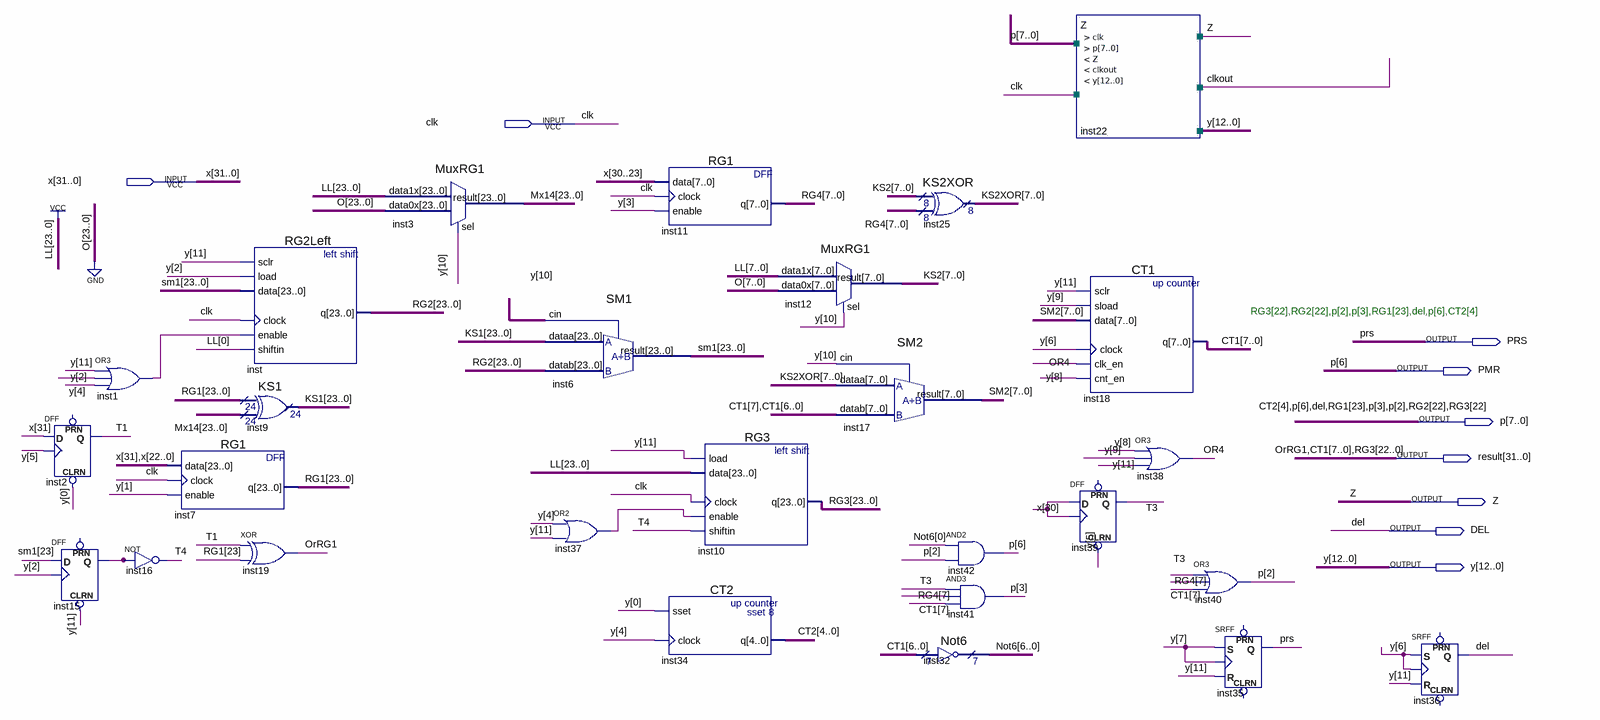
[diagram p0: schematic sheet]
// Quartus schematic courseProject.bdf as structural Verilog: 27 symbols, 9 pins
module courseProject (
  input  clk,
  input  [31:0] x,
  output PRS,
  output PMR,
  output [7:0] p,
  output [31:0] result,
  output Z,
  output DEL,
  output [12:0] y
);

  wire clkout, inst1_out, inst15_q, inst37_out, OR4, T1, T3, T4;
  wire [3:0] CT2;
  wire [6:0] Not6;
  wire [7:0] KS2, KS2XOR, RG4, SM2;
  wire [22:0] RG1;
  wire [23:0] KS1, Mx14, RG2, sm1;
  wire [23:23] RG3;

  DFF inst2 (.CLRN(y[0]), .CLK(y[5]), .D(x[31]), .Q(T1));  // open: PRN
  DFF inst15 (.CLRN(y[11]), .CLK(y[2]), .D(sm1[23]), .Q(inst15_q));  // open: PRN
  or inst1 (inst1_out, y[11], y[2], y[4]);
  not inst16 (T4, inst15_q);
  RG1 inst7 (.data({x[31], x[22:0]}), .clock(clk), .enable(y[1]), .q({p[4], RG1}));
  RG2Left inst (
    .sclr(y[11]), .load(y[2]), .data(sm1), .clock(clk), .enable(inst1_out), .shiftin(1'b1),
    .q({RG2[23], p[1], RG2[21:0]}));
  KS1 inst9 (.data0x({p[4], RG1}), .data1x(Mx14), .result(KS1));
  xor inst19 (result[31], T1, p[4]);
  MuxRG1 inst3 (.data1x({24{1'b1}}), .data0x({24{1'b0}}), .sel(y[10]), .result(Mx14));
  SM1 inst6 (.dataa(KS1), .datab({RG2[23], p[1], RG2[21:0]}), .cin(y[10]), .result(sm1));
  or inst37 (inst37_out, y[4], y[11]);
  RG1 inst11 (.data(x[30:23]), .clock(clk), .enable(y[3]), .q(RG4));
  RG3 inst10 (
    .load(y[11]), .data({24{1'b1}}), .clock(clk), .enable(inst37_out), .shiftin(T4),
    .q({RG3[23], p[0], result[21:0]}));
  CT2 inst34 (.sset(y[0]), .clock(y[4]), .q({p[7], CT2}));
  MuxRG1 inst12 (.data1x({8{1'b1}}), .data0x({8{1'b0}}), .sel(y[10]), .result(KS2));
  SM2 inst17 (.dataa(KS2XOR), .datab(result[30:23]), .cin(y[10]), .result(SM2));
  KS2XOR inst25 (.data0x(KS2), .data1x(RG4), .result(KS2XOR));
  Not6 inst32 (.data(result[29:23]), .result(Not6));
  and inst42 (p[6], Not6[0], p[2]);
  and inst41 (p[3], T3, RG4[7], result[30]);
  Z inst22 (.clk(clk), .p({p[7:6], DEL, p[4:0]}), .Z(Z), .clkout(clkout), .y(y));
  CT1 inst18 (.sclr(y[11]), .sload(y[9]), .data(SM2), .clock(y[6]), .clk_en(OR4), .cnt_en(y[8]), .q(result[30:23]));
  DFF inst39 (.CLRN(y[5]), .CLK(x[30]), .D(x[30]), .Q(T3));  // open: PRN
  or inst38 (OR4, y[8], y[9], y[11]);
  or inst40 (p[2], T3, RG4[7], result[30]);
  SRFF inst35 (.S(y[7]), .R(y[11]), .CLK(y[7]), .Q(PRS));  // open: PRN, CLRN
  SRFF inst36 (.S(y[6]), .R(y[11]), .CLK(y[6]), .Q(DEL));  // open: PRN, CLRN

  assign p[5] = DEL;
  assign PMR = p[6];
  assign result[22] = p[0];

  // Other names for the same wires on the sheet: CT1[7:0] = result[30:23]; CT2[4] = p[7]; OrRG1 = result[31];
  //   RG1[23] = p[4]; RG2[22] = p[1]; RG3[22:0] = {p[0], result[21:0]}

  // Notes on the sheet:
  //   RG3[22],RG2[22],p[2],p[3],RG1[23],del,p[6],CT2[4]
endmodule
